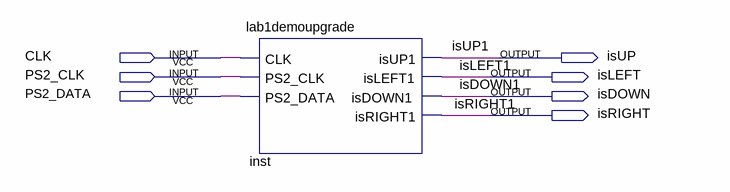
[diagram p0: schematic sheet]
// Quartus schematic Plocica2.bdf as structural Verilog: 1 symbols, 7 pins
module Plocica2 (
  input  CLK,
  input  PS2_CLK,
  input  PS2_DATA,
  output isUP,
  output isLEFT,
  output isDOWN,
  output isRIGHT
);

  lab1demoupgrade inst (
    .CLK(CLK), .PS2_CLK(PS2_CLK), .PS2_DATA(PS2_DATA), .isUP1(isUP), .isLEFT1(isLEFT), .isDOWN1(isDOWN),
    .isRIGHT1(isRIGHT));

  // Other names for the same wires on the sheet: isDOWN1 = isDOWN; isLEFT1 = isLEFT; isRIGHT1 = isRIGHT; isUP1 = isUP
endmodule
